# EAGLE design main-board_v1.9 (EAGLE 7.6.0)
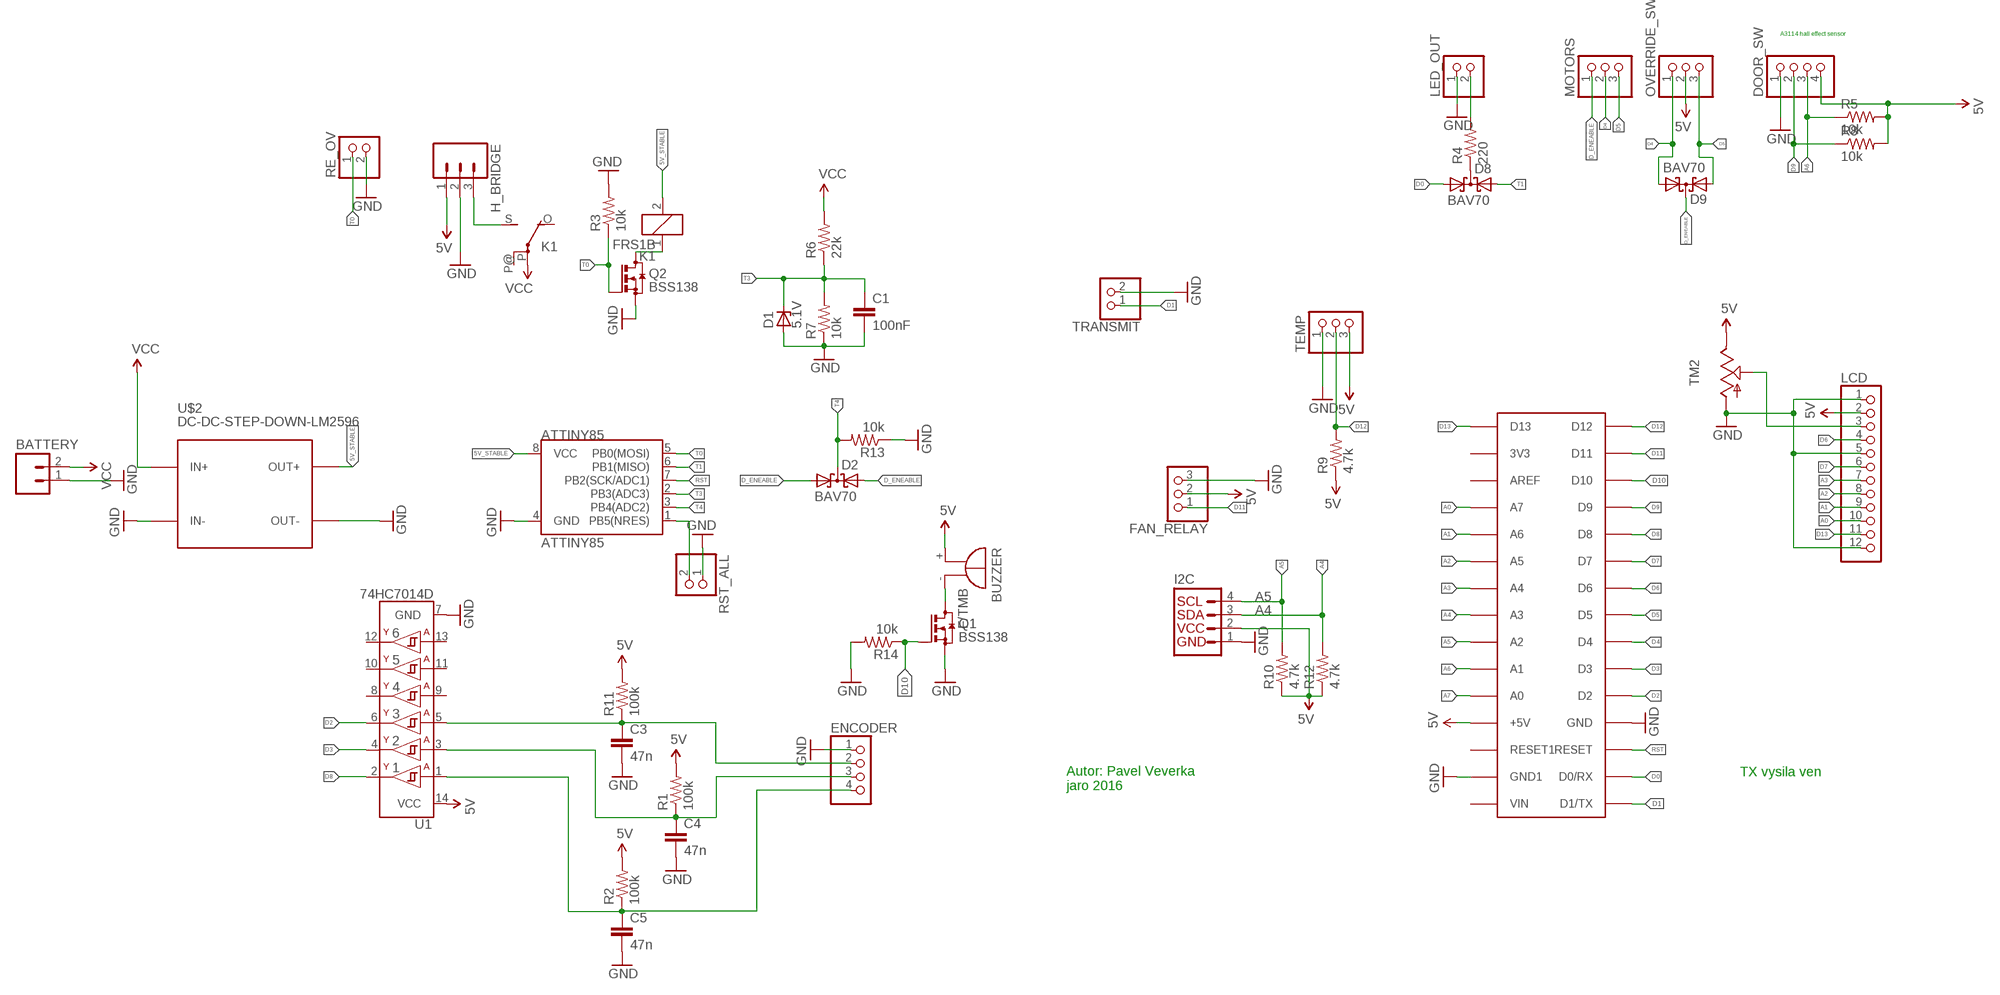
[diagram p0: schematic, sheet 1]

## Parts
ATTINY85  ATTINY85  ATTINY45TINY85-20-DIP  [DIP08]
BATTERY  M025MM  [SCREWTERMINAL-5MM-2]
BUZZER  F/TMB  [F/TMB]
C1  100nF  CAPPTH1  [CAP-PTH-5MM]
C3  47n  CAPPTH1  [CAP-PTH-5MM]
C4  47n  CAPPTH1  [CAP-PTH-5MM]
C5  47n  CAPPTH1  [CAP-PTH-5MM]
D1  5.1V  ZENER-DIODEZD-7.5  [ZDIO-7.5]
D2  BAV70  BAS70-05  [SOT23]
D8  BAV70  BAS70-05  [SOT23]
D9  BAV70  BAS70-05  [SOT23]
DOOR_SW  PINHD-1X4  [1X04]
ENCODER  PINHD-1X4  [1X04]
FAN_RELAY  PINHD-1X3  [1X03]
H_BRIDGE  M03-SCREW-5MM  [SCREWTERMINAL-5MM-3]
I2C  I2C_STANDARD  [1X04]
K1  FRS1B  [FRS1B]
LCD  PINHD-1X12  [1X12]
LED_OUT  PINHD-1X2  [1X02]
MOTORS  PINHD-1X3  [1X03]
NANO  NANO  ARDUINONANO  [PDIP-32]
OVERRIDE_SW  PINHD-1X3  [1X03]
Q1  BSS138  BSS123  [SOT23]
Q2  BSS138  BSS123  [SOT23]
R1  100k  RESISTOR1206  [1206]
R2  100k  RESISTOR1206  [1206]
R3  10k  RESISTOR1206  [1206]
R4  220  RESISTOR1206  [1206]
R5  10k  RESISTOR1206  [1206]
R6  22k  RESISTOR1206  [1206]
R7  10k  RESISTOR1206  [1206]
R8  10k  RESISTOR1206  [1206]
R9  4.7k  RESISTOR1206  [1206]
R10  4.7k  RESISTOR1206  [1206]
R11  100k  RESISTOR1206  [1206]
R12  4.7k  RESISTOR1206  [1206]
R13  10k  RESISTOR1206  [1206]
R14  10k  RESISTOR1206  [1206]
RE_OV  PINHD-1X2  [1X02]
RST_ALL  PINHD-1X2  [1X02]
TEMP  PINHD-1X3  [1X03]
TM2  TRIM  [6MM]
TRANSMIT  PINHD-1X2  [1X02]
U1  74HC7014D  [SOIC-14]
U$2  DC-DC-STEP-DOWN-LM2596  [DC-DC-STEP-DOWN-LM2596]

## Nets
5V: BUZZER.+ DOOR_SW.4 FAN_RELAY.2 H_BRIDGE.1 I2C.2 LCD.2 NANO.+5V OVERRIDE_SW.2 R1.2 R2.2 R5.2 R8.2 R9.1 R10.1 R11.2 R12.1 TEMP.3 TM2.E U1.14(VCC)
5V_STABLE: ATTINY85.8(VCC) K1.2 U$2.OUT+
A0: LCD.10 NANO.A7
A1: LCD.9 NANO.A6
A2: LCD.8 NANO.A5
A3: LCD.7 NANO.A4
A4: I2C.3 NANO.A3 R12.2
A5: I2C.4 NANO.A2 R10.2
A6: DOOR_SW.3 NANO.A1 R5.1
A7: NANO.A0
AS: C4.1 ENCODER.3 R1.1 U1.3(2A)
ASDF: C5.1 ENCODER.4 R2.1 U1.1(1A)
D0: D8.1(A1) NANO.D0/RX
D1: NANO.D1/TX TRANSMIT.1
D2: NANO.D2 U1.6(3Y)
D3: NANO.D3 U1.4(2Y)
D4: D9.1(A1) MOTORS.2 NANO.D4 OVERRIDE_SW.1
D5: D9.2(A2) MOTORS.3 NANO.D5 OVERRIDE_SW.3
D6: LCD.4 NANO.D6
D7: LCD.6 NANO.D7
D8: NANO.D8 U1.2(1Y)
D9: DOOR_SW.2 NANO.D9 R8.1
D10: NANO.D10 Q1.1(G) R14.1
D11: FAN_RELAY.1 NANO.D11
D12: NANO.D12 R9.2 TEMP.2
D13: LCD.11 NANO.D13
D_ENEABLE: D2.2(A2) D9.3(C) MOTORS.1
DS: C3.1 ENCODER.2 R11.1 U1.5(3A)
GND: ATTINY85.4(GND) BATTERY.1 C1.2 C3.2 C4.2 C5.2 D1.A DOOR_SW.1 ENCODER.1 FAN_RELAY.3 H_BRIDGE.2 I2C.1 LCD.1 LCD.5 LCD.12 LED_OUT.1 NANO.GND NANO.GND1 Q1.2(S) Q2.2(S) R3.2 R7.1 R13.1 R14.2 RE_OV.2 RST_ALL.1 TEMP.1 TM2.A TRANSMIT.2 U1.7(GND) U$2.IN- U$2.OUT-
N$1: ATTINY85.1(PB5(NRES)) RST_ALL.2
N$2: H_BRIDGE.3 K1.S(2:S)
N$3: D8.3(C) R4.1
N$4: D2.1(A1)
N$6: K1.1 Q2.3(D)
N$7: LED_OUT.2 R4.2
N$8: LCD.3 TM2.S
N$9: BUZZER.- Q1.3(D)
RST: ATTINY85.7(PB2(SCK/ADC1)) NANO.RESET
T0: ATTINY85.5(PB0(MOSI)) Q2.1(G) R3.1 RE_OV.1
T1: ATTINY85.6(PB1(MISO)) D8.2(A2)
T3: ATTINY85.2(PB3(ADC3)) C1.1 D1.C R6.1 R7.2
T4: ATTINY85.3(PB4(ADC2)) D2.3(C) R13.2
VCC: BATTERY.2 K1.P(2:P) R6.2 U$2.IN+
Unconnected: K1.O(2:O) K1.P@(2:P) NANO.3V3 NANO.AREF NANO.RESET1 NANO.VIN U1.8(4Y) U1.9(4A) U1.10(5Y) U1.11(5A) U1.12(6Y) U1.13(6A)

## Notes on the sheet
- A3114 hall effect sensor
- TX vysila ven
- Autor: Pavel Veverka
  jaro 2016

## Library data of the parts
ATTINY85 = SparkFun-DigitalIC:ATTINY45: Atmel 8-pin 2/4/8kB flash uC; PROD_ID: IC-09445; VALUE: TINY85-20-DIP
BATTERY = SparkFun-Connectors:M02: Standard 2-pin 0.1" header. Use with - straight break away headers ( PRT-00116) - right angle break away headers (PRT-00553) - swiss pins (PRT-00743) - machine pins (PRT-00117) - female headers (PRT-00115) Molex polarized connector foot print use with: PRT-08233 with associated crimp pins and housings. 2.54_SCREWTERM for use with PRT-10571. 3.5mm Screw Terminal footprints for PRT-08084 5mm Screw Terminal footprints for use with PRT-08432; STOREFRONT_ID: PRT-08432
BUZZER = buzzer:F/TMB: BUZZER Source: Buerklin; OC_FARNELL: unknown; OC_NEWARK: unknown
C1 C3-C5 = SparkFun-Capacitors:CAP: Capacitor Standard 0603 ceramic capacitor, and 0.1" leaded capacitor.
D1 = diode:ZENER-DIODE: Z-Diode
D2 D8 D9 = diode:BAS70-05: Silicon Schottky Diodes General-purpose diode for high-speed switching
DOOR_SW ENCODER = pinhead:PINHD-1X4: PIN HEADER
FAN_RELAY MOTORS OVERRIDE_SW TEMP = pinhead:PINHD-1X3: PIN HEADER
H_BRIDGE = SparkFun-Connectors:M03: Header 3 Standard 3-pin 0.1" header. Use with straight break away headers (SKU : PRT-00116), right angle break away headers (PRT-00553), swiss pins (PRT-00743), machine pins (PRT-00117), and female headers (PRT-00115). Molex polarized connector foot print use with SKU : PRT-08232 with associated crimp pins and housings.; STOREFRONT_ID: PRT-08433
I2C = SparkFun-Connectors:I2C_STANDARD: SparkFun has standardized on a pinout for all I2C based sensor breakouts. This pinout allows I2C boards to be plugged directly into the headers on Arduino Uno compatible boards, and to be daisy chained easily.
K1 = relay:FRS1B: RELAY 1 x switch, same as V23101-D6-A201, Siemens; OC_FARNELL: unknown; OC_NEWARK: unknown
LCD = pinhead:PINHD-1X12: PIN HEADER
LED_OUT RE_OV RST_ALL TRANSMIT = pinhead:PINHD-1X2: PIN HEADER
NANO = jet-lib:ARDUINONANO
Q1 Q2 = transistor-small-signal:BSS123: N-CHANNEL MOS FET
R1-R14 = SparkFun-Resistors:RESISTOR: Resistor Basic schematic elements and footprints for 0603, 1206, and PTH resistors.
TM2 = adafruit:TRIM
U1 = SparkFun-DigitalIC:74HC7014D: The 74HC7014 is a hex buffer with precision Schmitt-trigger inputs. The precisely defined trigger levels are lying in a window between (0.55 x VCC) and (0.65 x VCC). It makes the circuit suitable to operate in a highly noisy environment. Input shorts are allowed to -1.5 V and +16 V without disturbing other channels. Inputs include clamp diodes that enable the use of current limiting resistors to interface inputs to voltages in excess of VCC. Schmitt trigger inputs transform slowly changing input signals into sharply defined jitter-free output signals.; PROD_ID: IC-12527
U$2 = diy-modules:DC-DC-STEP-DOWN-LM2596: DC/DC Step-Down Regulator based on LM2596-ADJ chip

## Net classes
0 default: width 0.508 mm, clearance 0.6 mm

## Board
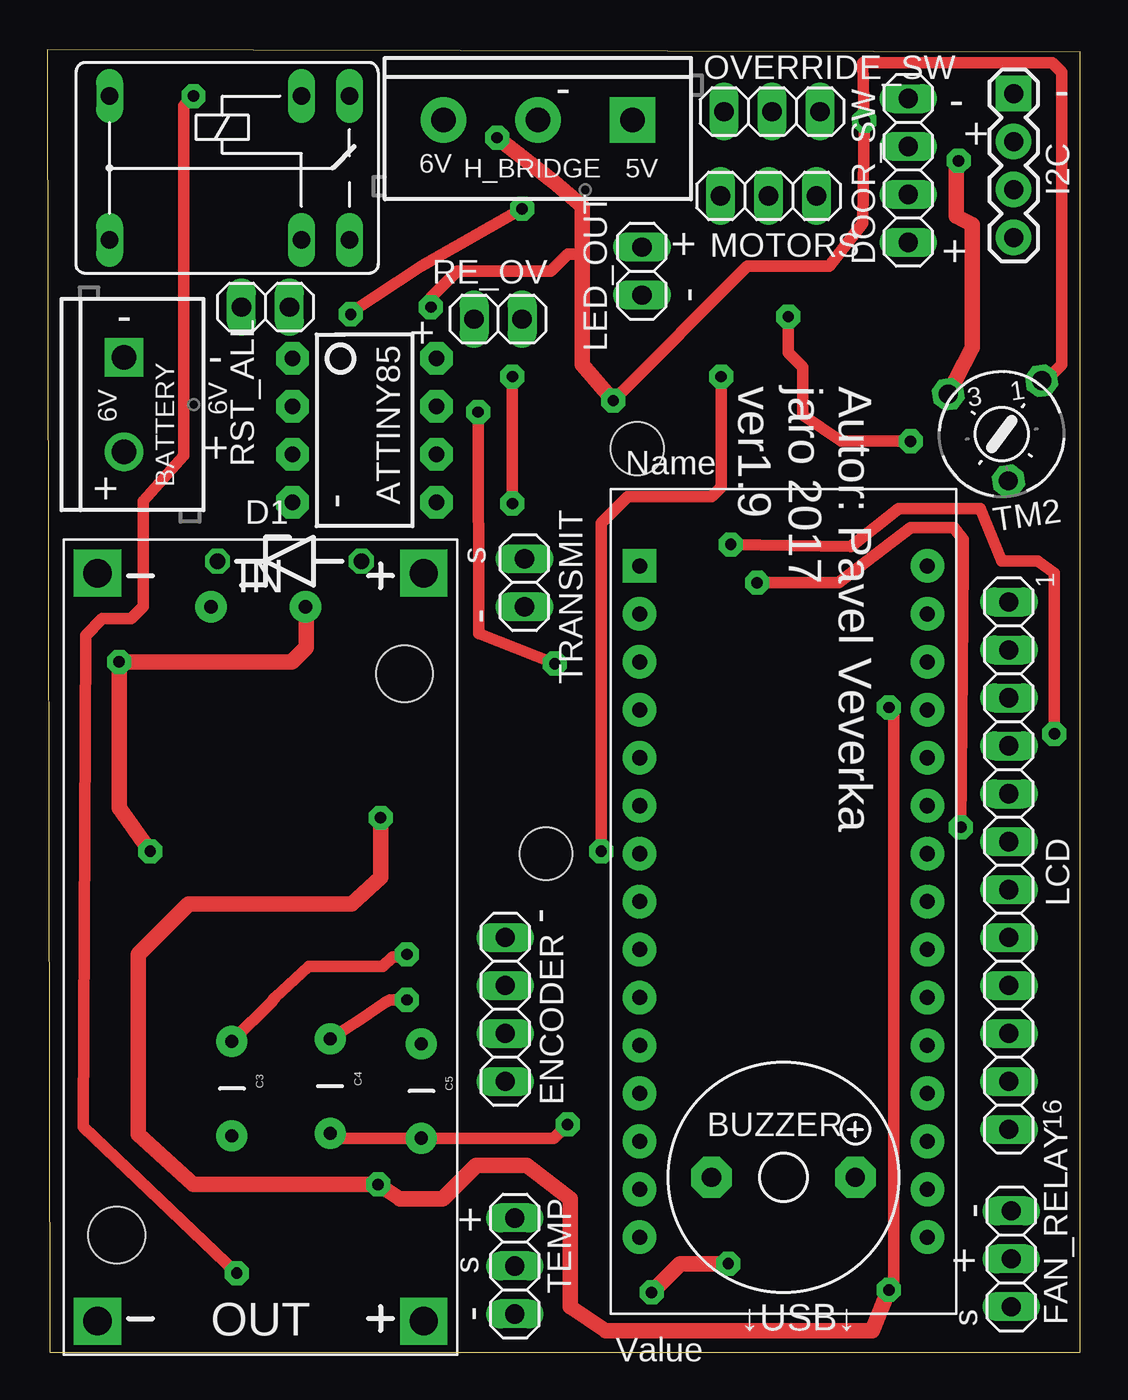
[diagram p1: board, top side]
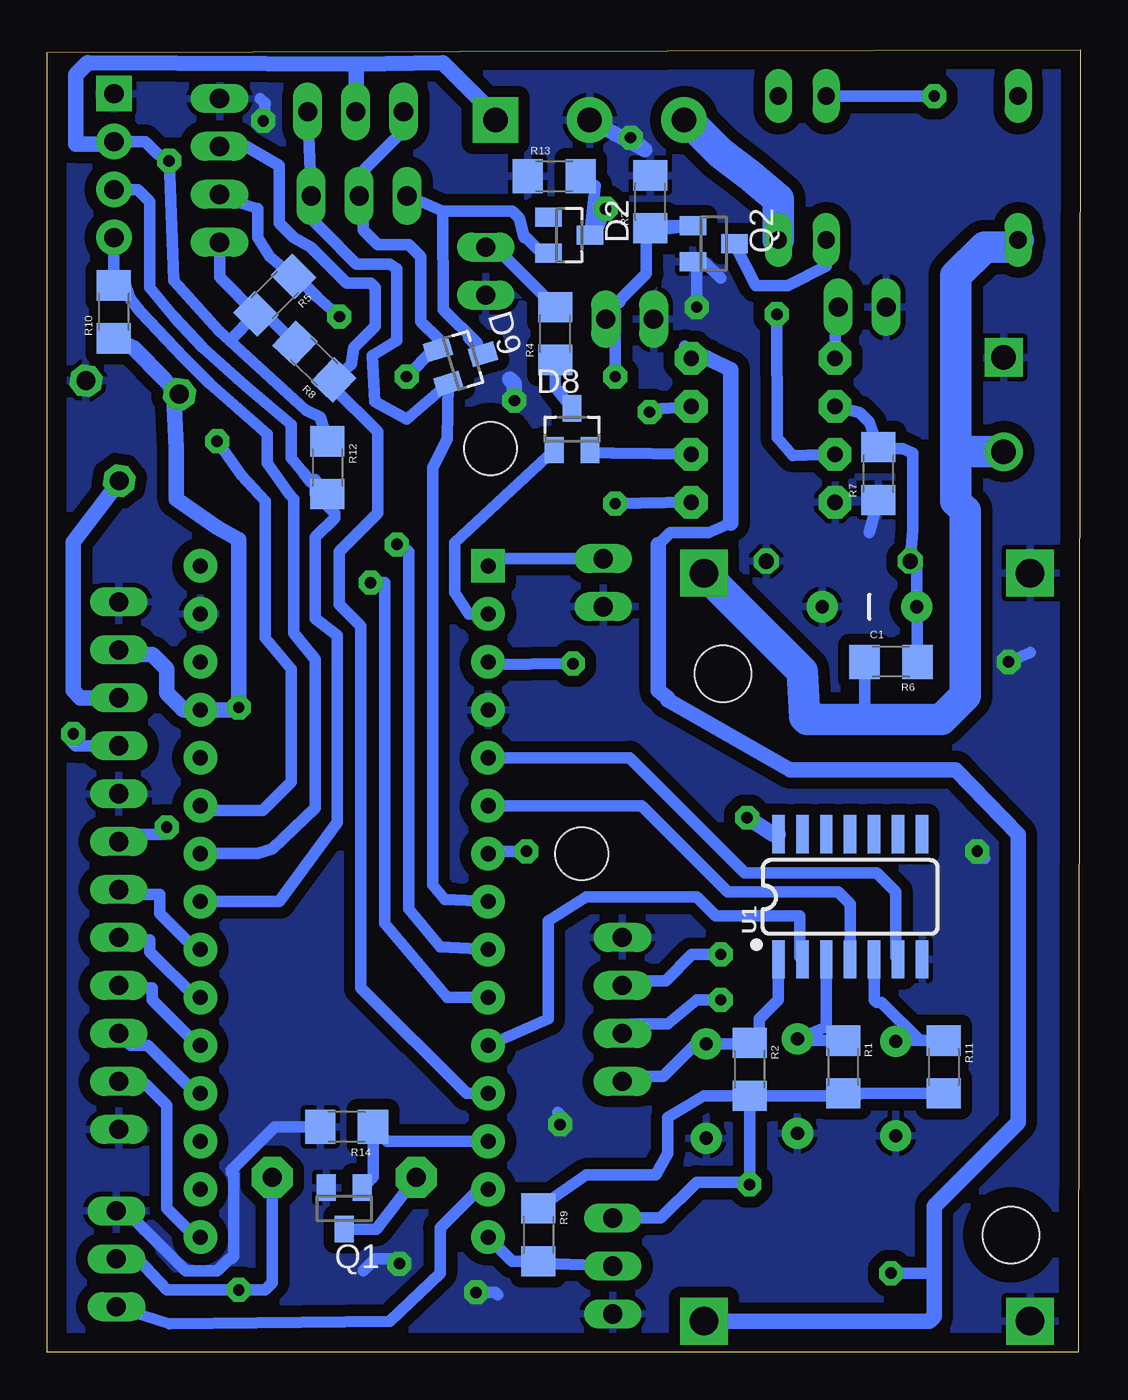
[diagram p2: board, bottom side, seen from below]

Size 54.72 x 69.01 mm. Coordinates in mm from the lower left corner, seen from the top.
Outline: 0.13,0 54.72,0 54.72,68.88 0,69.01 0.13,0
Copper layers (1*16): Top 0.035mm / dielectric 1.5mm / Bottom 0.035mm
Design rules "main-board_v1": minimum track width 10mil, minimum drill 24mil, track to track 0.205mm, track to pad 0.205mm, pad to pad 0.205mm, via to via 0.205mm, smd to smd 8mil, copper to edge 40mil, drill to drill 8mil, minimum pad ring 10mil, minimum via ring 8mil, stop-mask expansion 4mil, vias tented up to drill 0mil, thermal gap 10mil
Holes 2.8 mm at 26.42,26.42 31.24,47.88

### Footprints (pad centres in the part's own frame; a part is rotated, then mirrored left to right if it is on the bottom)
DIP08 = drill 0.813 pad 1.727 octagon: 1 -3.81,-3.81; 2 -1.27,-3.81; 3 1.27,-3.81; 4 3.81,-3.81; 5 3.81,3.81; 6 1.27,3.81; 7 -1.27,3.81; 8 -3.81,3.81
SCREWTERMINAL-5MM-2 = drill 1.3 pad 2.032 square: 1 0,0 | drill 1.3 pad 2.032: 2 5,0
F/TMB = drill 1.016 pad 2.159 octagon: + 3.81,0; - -3.81,0
CAP-PTH-5MM = drill 0.7 pad 1.651: 1 -2.5,0; 2 2.5,0
ZDIO-7.5 = drill 0.813 octagon: A 3.81,0; C -3.81,0
SOT23 = smd 1 x 1.4: 1 -0.95,-1.1; 2 0.95,-1.1; 3 0,1.1
1X04 = drill 1.016 long: 1 -3.81,0; 2 -1.27,0; 3 1.27,0; 4 3.81,0
1X03 = drill 1.016 long: 1 -2.54,0; 2 0,0; 3 2.54,0
SCREWTERMINAL-5MM-3 = drill 1.3 pad 2.413 square: 1 0,0 | drill 1.3 pad 2.413: 2 5,0; 3 10,0
1X04' = drill 1.016 pad 1.88 square: 1 0,0 | drill 1.016 pad 1.88: 2 2.54,0; 3 5.08,0; 4 7.62,0
FRS1B = drill 0.914 long: 1 0,3.81; 2 0,-3.81; O -2.54,-3.81; P 10.16,3.81; P@ 10.16,-3.81; S -2.54,3.81
1X12 = drill 1.016 long: 1 -13.97,0; 2 -11.43,0; 3 -8.89,0; 4 -6.35,0; 5 -3.81,0; 6 -1.27,0; 7 1.27,0; 8 3.81,0; 9 6.35,0; 10 8.89,0; 11 11.43,0; 12 13.97,0
1X02 = drill 1.016 long: 1 -1.27,0; 2 1.27,0
PDIP-32 = drill 0.8 pad 1.778: 3V3 15.24,-35.56; +5V 15.24,-10.16; A0 15.24,-12.7; A1 15.24,-15.24; A2 15.24,-17.78; A3 15.24,-20.32; A4 15.24,-22.86; A5 15.24,-25.4; A6 15.24,-27.94; A7 15.24,-30.48; AREF 15.24,-33.02; D0/RX 0,-5.08; D2 0,-12.7; D3 0,-15.24; D4 0,-17.78; D5 0,-20.32; D6 0,-22.86; D7 0,-25.4; D8 0,-27.94; D9 0,-30.48; D10 0,-33.02; D11 0,-35.56; D12 0,-38.1; D13 15.24,-38.1; GND 0,-10.16; GND1 15.24,-5.08; RESET 0,-7.62; RESET1 15.24,-7.62; VIN 15.24,-2.54 | drill 0.8 pad 1.778 square: D1/TX 0,-2.54
1206 = smd 1.6 x 1.8: 1 -1.4,0; 2 1.4,0
6MM = drill 1 pad 1.676 octagon: A -2.5,-2.5; E 2.5,-2.5; S 0,2.5
SOIC-14 = smd 0.66 x 2.032: 1 -4.445,-3.315; 2 -3.175,-3.315; 3 -1.905,-3.315; 4 -0.635,-3.315; 5 0.635,-3.315; 6 1.905,-3.315; 7 3.175,-3.315; 8 3.175,3.315; 9 1.905,3.315; 10 0.635,3.315; 11 -0.635,3.315; 12 -1.905,3.315; 13 -3.175,3.315; 14 -4.445,3.315
DC-DC-STEP-DOWN-LM2596 = drill 1.5 pad 2.5 square: IN+ -19.812,8.636; IN- -19.812,-8.636; OUT+ 19.812,8.636; OUT- 19.812,-8.636 | hole 3: -14.478,7.62; 15.24,-7.62

### Placement (x,y rotation side)
ATTINY85  16.8,48.84 270 top
BATTERY  4.06,52.71 270 top
BUZZER  38.99,9.27 0 top
C1  11.18,39.5 180 bottom
C3  9.78,13.97 270 top
C4  14.99,14.1 270 top
C5  19.81,13.84 270 top
D1  12.83,41.91 0 top
D2  27.08,59.18 270 bottom
D8  26.92,48.9 0 bottom
D9  32.69,52.55 287 bottom
DOOR_SW  45.59,62.61 270 top
ENCODER  24.26,18.16 270 top
FAN_RELAY  51.05,4.95 90 top
H_BRIDGE  30.99,65.28 180 top
I2C  [1X04']  51.18,66.67 270 top
K1  13.46,62.74 180 top
LCD  50.93,25.78 270 top
LED_OUT  31.5,57.28 90 top
MOTORS  38.2,61.26 0 top
NANO  31.37,44.2 0 top
OVERRIDE_SW  38.38,65.73 0 top
Q1  38.99,7.62 180 bottom
Q2  19.42,58.73 270 bottom
R1  12.57,15.11 270 bottom
R2  17.53,14.99 270 bottom
R3  22.78,60.94 90 bottom
R4  27.81,53.98 90 bottom
R5  42.67,56.01 225 bottom
R6  10.03,36.58 180 bottom
R7  10.7,46.55 90 bottom
R8  40.58,52.48 136.5 bottom
R9  28.7,6.22 270 bottom
R10  51.18,55.12 90 bottom
R11  7.24,15.11 270 bottom
R12  39.88,46.86 270 bottom
R13  27.87,62.3 0 bottom
R14  38.86,11.94 180 bottom
RE_OV  23.88,54.74 180 top
RST_ALL  11.56,55.37 0 top
TEMP  24.77,4.57 90 top
TM2  50.55,48.64 188.2 top
TRANSMIT  25.27,40.77 270 top
U1  11.56,24.13 0 bottom
U$2  11.3,21.46 270 top

### Tracks (layer width: path | path; a pad name or v marks a point on that pad's centre or on a via)
5V  (via drill 0.6 pad 1.27)
  Top 0.61: v17.53,8.89 17.53,9.14 17.4,9.02 | v44.58,34.16 44.83,33.78 44.83,3.3 v44.58,3.3
  Top 0.813: v48.26,63.12 48.13,62.99 48.13,60.2 48.98,59.73 48.98,53.22 TM2.E 47.62,51.1 | v44.58,3.3 43.69,1.14 29.59,1.14 27.69,2.41 27.69,8.13 25.4,9.91 22.73,9.91 20.96,8.13 18.67,8.13 v17.53,8.89 7.75,8.89 4.83,11.56 4.83,21.08 7.49,23.75 16.13,23.75 17.65,25.15 v17.65,28.32
  Bottom 0.61: R2.2 11.81,13.59 R1.2 R11.2 | R2.2 19.94,13.59 21.84,12.45 21.84,10.54 22.48,9.4 26.16,9.4 R9.1 | I2C.2 49.53,64.13 48.9,63.5 v48.26,63.12 48.01,56.77 45.6,54.11 45.05,53.6 | R12.1 40.26,49.53 41.02,49.91 45.05,53.6 | R2.2 v17.53,8.89 17.65,9.02 20.32,9.02 22.23,7.11 TEMP.3 | FAN_RELAY.2 49.91,4.95 48.39,3.3 v44.58,3.3 43.18,3.3 42.8,3.68 BUZZER.+ | R5.2 43.71,55.02 43.71,54.93 45.05,53.6 | R5.2 43.17,55.02 R8.2 | DOOR_SW.4 45.59,56.95 R5.2
  Bottom 0.813: H_BRIDGE.1 30.99,65.53 33.78,68.33 38.35,68.24 | 38.35,68.24 52.58,68.33 53.21,67.69 53.21,64.01 51.31,64.01 I2C.2 | OVERRIDE_SW.2 38.35,68.24 | LCD.2 50.67,36.96 49.15,36.96 48.39,36.2 48.39,34.93 47.5,34.04 NANO.+5V 44.83,34.04 v44.58,34.16 44.58,43.05 45.72,43.69 47.88,45.21 47.88,47.88 48.01,50.72 TM2.E 48.09,51.05 48.51,51.56 50.16,53.21 R10.1 | U1.14 16.27,27.45 v17.65,28.32
5V_STABLE  (via drill 0.6 pad 1.27)
  Top 0.61: v7.75,66.55 7.24,66.04 7.24,47.5 5.08,45.09 5.08,39.5 4.45,38.86 2.92,38.86 2.03,37.97 1.91,11.94 v10.03,4.19
  Bottom 0.61: 18.52,43.94 19.68,43.43 21.72,43.43 22.35,42.8 | K1.2 v7.75,66.55 | v10.03,4.19 7.75,4.19 | 20.96,53.3 20.79,53.13
  Bottom 0.813: U$2.OUT+ 8,1.65 7.75,1.9 7.75,4.19 7.75,7.75 3.3,12.19 3.3,27.43 6.6,30.86 15.37,30.86 21.84,34.54 21.84,34.67 22.35,35.05 22.35,42.8 | 20.79,53.13 ATTINY85.8 19.81,52.71 18.52,52.07 18.52,43.94
A0
  Bottom 0.61: NANO.A7 46.86,13.72 49.4,16.26 50.29,16.26 LCD.10
A1
  Bottom 0.61: NANO.A6 46.74,16.26 49.15,18.67 49.15,19.3 50.8,19.3 LCD.9
A2
  Bottom 0.61: NANO.A5 46.86,18.8 49.28,21.21 49.28,21.84 50.8,21.84 LCD.8
A3
  Bottom 0.61: NANO.A4 46.86,21.34 48.77,23.24 48.77,24.26 50.67,24.26 LCD.7
A4
  Bottom 0.61: NANO.A3 42.42,23.88 39.37,28.07 39.37,37.97 40.51,38.86 40.51,43.18 39.5,44.2 39.5,44.45 40.51,45.47 40.51,46.23 R12.2 40.77,46.1 41.15,46.61 41.78,47.37 41.78,49.15 44.2,51.18 46.48,53.21 48.01,54.86 49.28,56.39 49.28,60.96 49.91,61.59 I2C.3
A5
  Bottom 0.61: NANO.A2 43.56,26.42 42.8,26.67 40.51,28.83 40.51,36.7 41.66,38.1 41.66,45.21 41.91,45.47 43.05,47.12 43.05,48.64 46.1,51.31 47.5,52.71 49.78,55.12 50.29,55.75 50.55,56.52 R10.2 I2C.4
A6  (via drill 0.6 pad 1.27)
  Top 0.61: v39.24,54.86 39.24,52.96 40.01,52.2 40.01,49.66 42.04,48.26 v45.72,48.26
  Bottom 0.61: v45.72,48.26 44.45,46.48 43.18,45.09 43.18,37.85 41.78,36.2 41.78,30.23 43.31,28.7 46.35,28.7 NANO.A1 | v39.24,54.86 40.39,55.88 41.15,56.64 41.33,56.64 R5.1 42.93,58.04 43.56,59.05 43.56,60.58 45.59,61.21 DOOR_SW.3
AS  (via drill 0.6 pad 1.27)
  Top 0.61: v19.05,18.67 18.16,18.67 17.91,18.54 16.64,17.65 C4.1
  Bottom 0.61: R1.1 14.18,16.51 C4.1 13.46,17.23 U1.3 | v19.05,18.67 20.32,18.67 21.84,17.4 23.75,17.4 ENCODER.3
ASDF
  Bottom 0.61: ENCODER.4 24,14.61 22.1,14.61 20.36,16.34 C5.1 16.93,16.34 R2.1 17.02,16.51 17.02,17.65 16,18.67 U1.1
D0
  Bottom 0.61: NANO.D0/RX 32.38,39.12 33.15,40.26 33.15,42.9 D8.1
D1
  Bottom 0.61: TRANSMIT.1 30.99,42.04 NANO.D1/TX
D2
  Bottom 0.61: NANO.D2 23.88,31.5 17.78,25.4 10.79,25.4 9.78,24.38 9.78,20.94 U1.6
D3
  Bottom 0.61: NANO.D3 23.24,28.96 18.67,24.38 12.83,24.38 12.19,23.75 U1.4
D4  (via drill 0.6 pad 1.27)
  Top 0.61: v35.69,51.69 35.69,45.85 35.18,45.34 30.73,45.34 29.34,43.94 v29.34,26.54
  Bottom 0.61: v35.69,51.69 34.24,53.14 D9.1 34.02,53.71 34.92,54.61 34.92,58.04 35.56,58.67 37.21,58.67 37.97,59.44 37.97,60.53 MOTORS.2 38.35,60.91 38.35,62.23 35.84,64.74 OVERRIDE_SW.1 | v29.34,26.54 31.24,26.54 NANO.D4
D5
  Bottom 0.61: OVERRIDE_SW.3 MOTORS.3 40.9,60.22 | 40.9,60.22 40.8,60.49 | NANO.D5 33.66,24 34.29,24.76 34.29,46.86 33.54,48.38 D9.2 35.68,49.44 37.37,50.38 37.5,52.8 36.2,53.59 36.2,57.4 36.58,57.66 38.35,57.66 40.13,59.44 40.24,59.56 40.9,60.22
D6  (via drill 0.6 pad 1.27)
  Top 0.61: v36.2,42.8 42.55,42.67 45.09,44.7 49.4,44.7 50.55,41.91 52.45,41.91 53.34,41.28 53.34,32.89 53.47,32.77 v53.34,32.77
  Bottom 0.61: v53.34,32.77 53.47,32.39 53.21,32.13 LCD.4 | v36.2,42.8 35.56,42.42 35.56,23.49 33.91,21.46 NANO.D6
D7  (via drill 0.6 pad 1.27)
  Top 0.61: v37.59,40.77 41.91,40.77 45.72,43.69 48.01,43.69 48.51,43.05 48.51,41.78 v48.39,27.81
  Bottom 0.61: NANO.D7 33.53,18.8 36.83,22.73 36.83,40.77 v37.59,40.77 | v48.39,27.81 48.39,27.56 48.51,27.43 50.55,27.43 LCD.6
D8
  Bottom 0.61: NANO.D8 28.19,17.65 28.19,22.86 26.16,24.13 20.32,24.13 19.3,23.11 14.86,23.11 14.86,20.94 U1.2
D9
  Bottom 0.61: NANO.D9 32.51,13.72 38.1,19.3 38.1,38.48 39.24,39.62 39.24,42.42 37.21,44.45 37.21,48.77 39.56,51.12 R8.1 38.61,52.33 38.48,53.21 37.34,54.36 37.34,56.39 37.59,56.64 38.86,56.64 40.77,58.55 41.66,59.05 42.42,59.82 42.42,62.87 44.2,63.88 DOOR_SW.2
D10
  Bottom 0.61: NANO.D10 36.7,11.18 R14.1 37.46,9.3 Q1.1
D11
  Bottom 0.61: NANO.D11 31.88,8.64 33.91,6.6 33.91,4.19 36.58,1.65 48.26,1.52 FAN_RELAY.1
D12
  Bottom 0.61: TEMP.2 27.82,4.7 R9.2 30.1,4.82 NANO.D12
D13
  Bottom 0.61: NANO.D13 46.99,6.1 46.99,6.22 48.39,7.62 48.39,13.08 49.53,14.22 50.8,14.22 LCD.11
D_ENEABLE
  Bottom 0.406: D9.3 31.75,52.87 31.75,52.83
  Bottom 0.61: D9.3 31.71,53.05 32.38,53.72 | D2.2 28.13,58.11 28.7,58.42 29.34,59.05 29.46,59.05 29.72,60.07 30.1,60.45 33.78,60.45 | 33.78,60.45 MOTORS.1 | 33.78,60.45 33.73,55.24 31.96,53.46 32,53.09 31.75,52.83 31.62,52.71
DS  (via drill 0.6 pad 1.27)
  Top 0.61: v19.05,21.08 18.8,20.95 18.29,20.95 17.78,20.45 13.84,20.45 12.06,18.8 11.94,18.67 11.94,18.63 C3.1
  Bottom 0.61: R11.1 8.47,16.51 | 8.47,16.51 C3.1 | 8.47,16.51 8.51,16.51 10.54,18.54 10.79,18.54 10.92,18.67 U1.5 | v19.05,21.08 20.57,21.08 21.97,19.68 24,19.68 ENCODER.2
GND  (via drill 0.6 pad 1.27)
  Top 0.61: v27.56,12.07 26.84,11.34 C5.2 15.24,11.34 C4.2 | 52.92,51.52 53.72,52.32 53.72,67.82 53.21,68.33 43.18,68.33 v43.28,65.24 43.18,59.82 41.4,57.53 37.08,57.53 v29.97,50.42 | v20.32,55.37 20.32,55.88 21.72,57.28 26.67,57.28 27.56,58.17 28.32,58.17
  Top 0.813: v5.46,26.54 3.81,28.83 v3.81,36.58 12.95,36.58 13.72,37.34 13.72,39.46 C1.2 13.59,39.58 | v23.82,64.35 26.84,61.99 28.32,60.71 28.32,58.17 28.32,52.32 v29.97,50.42 | TM2.A 52.92,51.52 | v36.07,4.7 33.53,4.7 v32,3.17
  Bottom 0.61: 43.43,66.42 43.18,66.17 v43.28,65.24 | v27.56,12.07 27.56,12.57 27.69,12.7 | R7.1 11.18,43.43 | v3.81,36.58 2.67,37.08 | 5.08,26.16 v5.46,26.54 | R14.2 42.67,11.94 44.96,9.65 44.96,9.53 44.83,9.4 44.83,5.08 44.96,4.95 45.09,4.95 45.72,4.32 47.37,4.32 50.42,7.37 50.93,7.37 FAN_RELAY.3 | 19.05,56.9 19.94,57.79 Q2.2 20.32,57.79 v20.32,55.37 | 37.97,4.32 37.34,4.95 36.32,4.95 v36.07,4.7 | v32,3.17 30.99,3.17 30.86,3.05
  Bottom 0.813: H_BRIDGE.2 23.07,63.71 v23.82,64.35 | v29.97,50.42 29.97,51.31 30.23,51.56
  pour Bottom: -0.25,68.83 54.74,68.71 54.86,0.13 -0.25,-0.38
N$1
  Bottom 0.61: RST_ALL.2 12.95,55.25 ATTINY85.1
N$2
  Bottom 1.676: K1.S 16,61.09 17.53,62.36 19.05,63.52 20.48,64.94 H_BRIDGE.3
N$3
  Bottom 0.61: R4.1 27.81,51.14 D8.3
N$6
  Bottom 0.61: K1.1 13.46,57.53 15.49,56.52 17.19,56.52 Q2.3
N$7
  Bottom 0.61: LED_OUT.2 30.98,58.55 R4.2
N$8
  Bottom 0.813: TM2.S 50.89,46.14 53.34,42.93 53.34,35.05 52.96,34.67 LCD.3
N$9
  Bottom 0.61: Q1.3 37.3,6.52 BUZZER.-
RST  (via drill 0.6 pad 1.27)
  Top 0.61: v22.82,49.8 22.84,38.07 v26.87,36.48
  Bottom 0.61: ATTINY85.7 22.18,49.99 v22.82,49.8 | v26.87,36.48 31.24,36.45 NANO.RESET
T0  (via drill 0.6 pad 1.27)
  Top 0.61: v24.64,51.69 v24.64,44.97
  Bottom 0.61: v24.64,51.69 24.64,55.12 24.68,55.12 24.79,55.23 | v24.64,44.97 ATTINY85.5 | 23.37,59.71 Q2.1 22.56,59.41 R3.1 22.99,59.34 22.99,57.15 24.37,55.77 24.37,55.66 24.59,55.5 24.79,55.23 | RE_OV.1 24.79,55.23
T1
  Bottom 0.61: D8.2 25.95,47.67 24.77,47.62 ATTINY85.6
T3
  Bottom 0.61: R6.1 8.63,39.03 C1.1 8.68,41.49 D1.C 8.89,43.56 8.89,47.62 9.4,47.88 11.05,47.88 R7.2 11.18,49.28 11.68,49.78 ATTINY85.2
T4  (via drill 0.6 pad 1.27)
  Top 0.61: v16.08,54.99 16.08,55.07 19.81,57.53 v25.15,60.58
  Bottom 0.61: v25.15,60.58 25.7,59.13 D2.3 25.7,61.8 R13.2 | v16.08,54.99 16.05,48.45 15.23,47.51 ATTINY85.3
VCC
  Bottom 0.61: R6.2 11.43,33.79 | 11.43,33.79 11.43,33.78 | 11.43,33.79 12.57,33.79 12.83,33.53
  Bottom 1.676: 6.6,47.71 6.6,57.02 5.08,58.55 3.68,58.55 K1.P | U$2.IN+ 14.73,36.07 14.61,33.66 14.48,33.53 12.83,33.53 7.37,33.53 6.1,34.8 6.1,44.58 6.6,45.09 6.6,47.62 6.6,47.71 | BATTERY.2 6.6,47.71

### Text on the board
tNames: - | - | - | + | 6V | 5V | + | + | - | - | + | - | Autor: Pavel Veverka / jaro 2017 / ver1.9 | 6V | 6V | + | + | - | s | 1 | - | - | 16 | - | + | s | + | - | s | ↓USB↓